# EAGLE design LiPoDisp (EAGLE 5.07)
BEST: Farnell 1081223
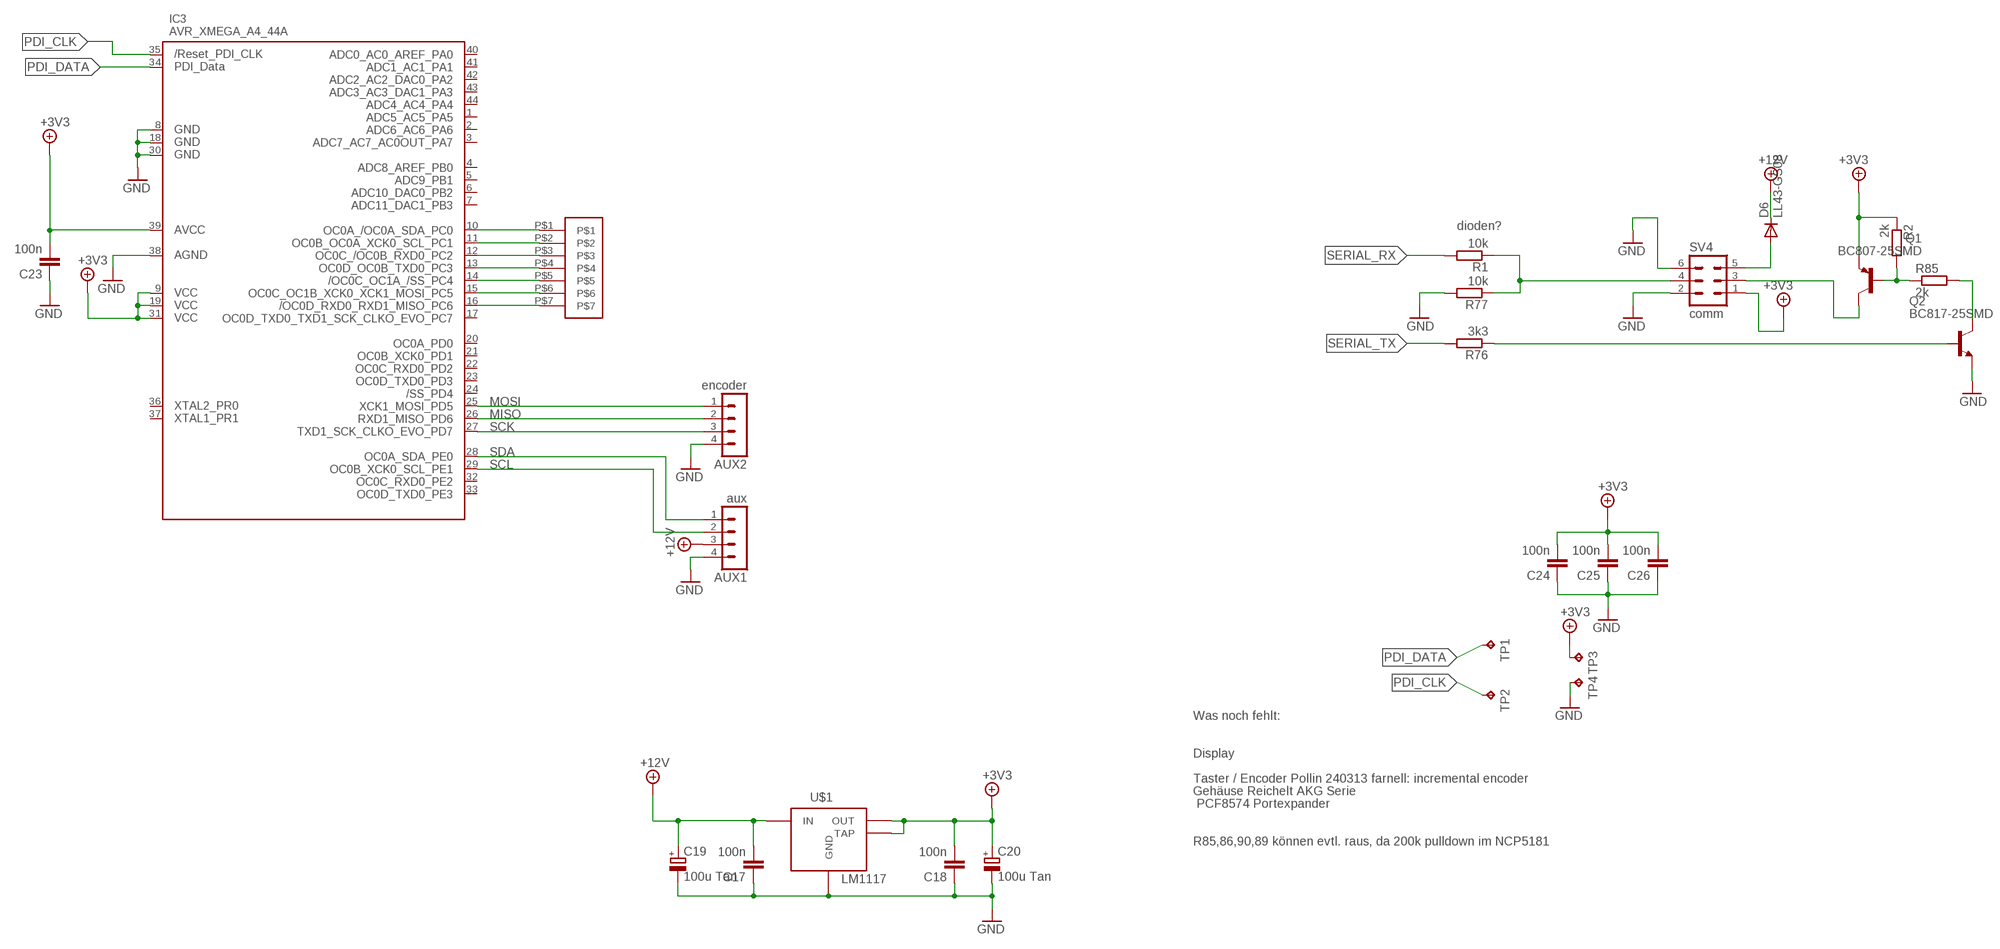
[diagram p0: schematic, sheet 1]

## Parts
AUX1  aux  MA04-1  [MA04-1]
AUX2  encoder  MA04-1  [MA04-1]
C17  100n  C-EUC0603K  [C0603K]
C18  100n  C-EUC0603K  [C0603K]
C19  100u Tan  CPOL-EUSMCC  [SMC_C]
C20  100u Tan  CPOL-EUSMCC  [SMC_C]
C23  100n  C-EUC0603K  [C0603K]
C24  100n  C-EUC0603K  [C0603K]
C25  100n  C-EUC0603K  [C0603K]
C26  100n  C-EUC0603K  [C0603K]
D6  LL43-GS08  DIODE-SOD80C  [SOD80C]
IC3  AVR_XMEGA_A4_44A  [TQFP44]
Q1  BC807-25SMD  [SOT23-BEC]
Q2  BC817-25SMD  [SOT23-BEC]
R1  10k  R-EU_R0603  [R0603]
R2  2k  R-EU_R0603  [R0603]
R76  3k3  R-EU_R0603  [R0603]
R77  10k  R-EU_R0603  [R0603]
R85  2k  R-EU_R0603  [R0603]
SV4  comm  ML6L  [ML6L]
TP1  TPTP15R  [TP15R]
TP2  TPTP15R  [TP15R]
TP3  TPTP15R  [TP15R]
TP4  TPTP15R  [TP15R]
U$1  LM1117  [SOT223]
U$3  SLIDER-7  [TP7-36]

## Nets
+3V3 [Lo-Power]: C18.2 C20.+ C23.2 C24.2 C25.2 C26.2 IC3.9(VCC1) IC3.19(VCC2) IC3.31(VCC3) IC3.39(AVCC) Q1.E R2.1 SV4.1 TP3.TP U$1.MID(OUT) U$1.TAP
+12V [Lo-Power]: AUX1.3 C17.2 C19.+ D6.C U$1.RIGHT(IN)
GND [Lo-Power]: AUX1.4 AUX2.4 C17.1 C18.1 C19.- C20.- C23.1 C24.1 C25.1 C26.1 IC3.8(GND1) IC3.18(GND2) IC3.30(GND3) IC3.38(AGND) Q2.E R77.2 SV4.2 SV4.6 TP4.TP U$1.LEFT(GND)
MISO: AUX2.2 IC3.26(PD6)
MOSI: AUX2.1 IC3.25(PD5)
N$2: Q2.C R85.2
N$3: Q1.C SV4.3
N$4: Q1.B R2.2 R85.1
N$5: IC3.10(PC0) U$3.P$1
N$6: IC3.11(PC1) U$3.P$2
N$7: IC3.12(PC2) U$3.P$3
N$8: IC3.13(PC3) U$3.P$4
N$9: IC3.14(PC4) U$3.P$5
N$10: Q2.B R76.1
N$11: IC3.15(PC5) U$3.P$6
N$12: IC3.16(PC6) U$3.P$7
N$84 [Lo-Power]: D6.A SV4.5
PDI_CLK: IC3.35(RESET) TP2.TP
PDI_DATA: IC3.34(PDI_DATA) TP1.TP
SCK: AUX2.3 IC3.27(PD7)
SCL: AUX1.2 IC3.29(PE1)
SDA: AUX1.1 IC3.28(PE0)
SERIAL_RX: R1.2
SERIAL_RX_R: R1.1 R77.1 SV4.4
SERIAL_TX: R76.2
Unconnected: IC3.1(PA5) IC3.2(PA6) IC3.3(PA7) IC3.4(PB0) IC3.5(PB1) IC3.6(PB2) IC3.7(PB3) IC3.17(PC7) IC3.20(PD0) IC3.21(PD1) IC3.22(PD2) IC3.23(PD3) IC3.24(PD4) IC3.32(PE2) IC3.33(PE3) IC3.36(PR0) IC3.37(PR1) IC3.40(PA0) IC3.41(PA1) IC3.42(PA2) IC3.43(PA3) IC3.44(PA4)

## Notes on the sheet
- dioden?
- Was noch fehlt:
- Display
- Taster / Encoder Pollin 240313 farnell: incremental encoder
- Gehäuse Reichelt AKG Serie
- PCF8574 Portexpander
- R85,86,90,89 können evtl. raus, da 200k pulldown im NCP5181

## Library data of the parts
AUX1 AUX2 = Fabian:MA04-1: PIN HEADER
C17 C18 C23-C26 = rcl:C-EU: CAPACITOR, European symbol
C19 C20 = rcl:CPOL-EU: POLARIZED CAPACITOR, European symbol
D6 = diode:DIODE-: DIODE
IC3 = xmega:AVR_XMEGA_A4_: Device for Atmel AVR XMEGA A4 Series
Q1 = transistor-pnp:BC807*: PNP Transistror
Q2 = transistor-npn:BC817*: NPN Transistor
R1 R2 R76 R77 R85 = rcl:R-EU_: RESISTOR, European symbol
SV4 = con-harting-ml:ML6: HARTING
TP1-TP4 = testpad:TP: Test pad
U$1 = Fabian:LM1117: lm1117 from National semi, buy from onlinecomponents.com add at least 10 uF at output Order No: LM1117MP-3.3
U$3 = Touch-pads:SLIDER-7

## Net classes
0 default: width 0.2 mm
1 Hi-Power: width 0.3 mm
2 Lo-Power: width 0.3 mm
3 Iso-bus: clearance 0.6 mm to class 0, clearance 0.6 mm to class 1, clearance 0.6 mm to class 2

## Board
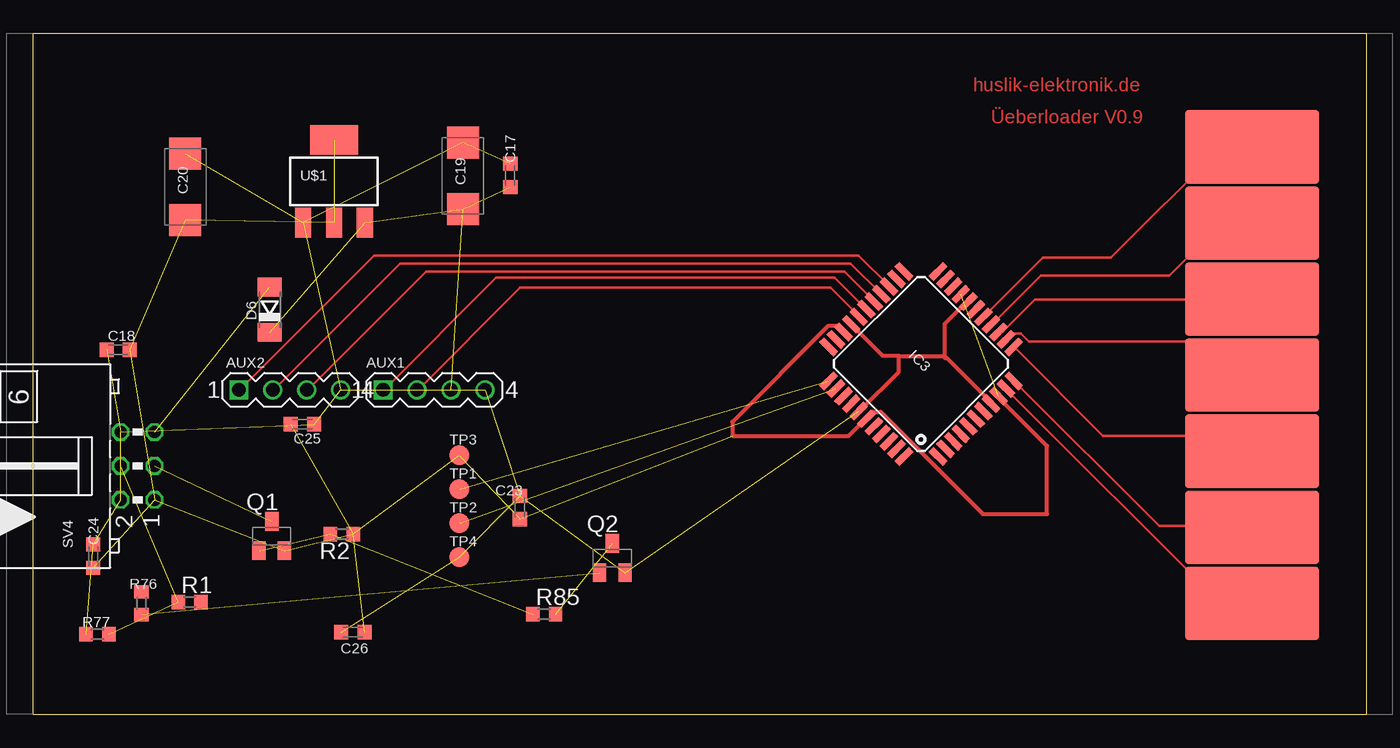
[diagram p1: board, top side]

Size 99.8 x 51 mm. Coordinates in mm from the lower left corner, seen from the top.
Copper layers (1*16): Top 0.035mm / dielectric 1.5mm / Bottom 0.035mm
Design rules "Fischer-LP *": minimum track width 0.15mm, minimum drill 0.3mm, track to track 0.15mm, track to pad 0.15mm, pad to pad 0.15mm, via to via 0.15mm, smd to smd 0mil, copper to edge 0.2mm, drill to drill 0.3mm, minimum pad ring 0.2mm, minimum via ring 0.15mm, stop-mask expansion 0.1mm, vias tented up to drill 0.5mm, thermal gap 0.15mm

### Footprints (pad centres in the part's own frame; a part is rotated, then mirrored left to right if it is on the bottom)
MA04-1 = drill 1.016 square: 1 -3.81,0 | drill 1.016 round: 2 -1.27,0; 3 1.27,0; 4 3.81,0
C0603K = smd 1.05 x 1.08: 1 -0.875,0; 2 0.875,0
SMC_C = smd 2.4 x 2.4: + -2.5,0; - 2.5,0
SOD80C = smd 1.4 x 1.8: A 1.7,0; C -1.7,0
TQFP44 = smd 1.5 x 0.5: 1 -5.8,4; 2 -5.8,3.2; 3 -5.8,2.4; 4 -5.8,1.6; 5 -5.8,0.8; 6 -5.8,0; 7 -5.8,-0.8; 8 -5.8,-1.6; 9 -5.8,-2.4; 10 -5.8,-3.2; 11 -5.8,-4; 23 5.8,-4; 24 5.8,-3.2; 25 5.8,-2.4; 26 5.8,-1.6; 27 5.8,-0.8; 28 5.8,0; 29 5.8,0.8; 30 5.8,1.6; 31 5.8,2.4; 32 5.8,3.2; 33 5.8,4 | smd 0.5 x 1.5: 12 -4,-5.8; 13 -3.2,-5.8; 14 -2.4,-5.8; 15 -1.6,-5.8; 16 -0.8,-5.8; 17 0,-5.8; 18 0.8,-5.8; 19 1.6,-5.8; 20 2.4,-5.8; 21 3.2,-5.8; 22 4,-5.8; 34 4,5.8; 35 3.2,5.8; 36 2.4,5.8; 37 1.6,5.8; 38 0.8,5.8; 39 0,5.8; 40 -0.8,5.8; 41 -1.6,5.8; 42 -2.4,5.8; 43 -3.2,5.8; 44 -4,5.8
SOT23-BEC = smd 1 x 1.4: B -0.95,-1.1; C 0,1.1; E 0.95,-1.1
R0603 = smd 1 x 1.1: 1 -0.85,0; 2 0.85,0
ML6L = drill 0.914 octagon: 1 -2.54,-1.27; 2 -2.54,1.27; 3 0,-1.27; 4 0,1.27; 5 2.54,-1.27; 6 2.54,1.27
TP15R = smd 1.5 x 1.5: TP 0,0
SOT223 = smd 1.219 x 2.235: LEFT -2.311,-3.099; MID 0,-3.099; RIGHT 2.311,-3.099 | smd 3.6 x 2.2: TAP 0,3.099
TP7-36 = smd 5.5 x 10: P$1 2.75,-5; P$2 8.45,-5; P$3 14.15,-5; P$4 19.85,-5; P$5 25.55,-5; P$6 31.25,-5; P$7 36.95,-5

### Placement (x,y rotation side)
AUX1  30,24.3 0 top
AUX2  19.2,24.3 0 top
C17  35.7,40.35 270 top
C18  6.35,27.3 0 top
C19  32.17,40.33 90 top
C20  11.38,39.5 90 top
C23  36.43,15.49 270 top
C24  4.48,11.86 270 top
C25  20.16,21.71 180 top
C26  23.93,6.14 0 top
D6  17.7,30.3 90 top
IC3  66.47,26.24 135 top
Q1  17.85,13.35 0 top
Q2  43.35,11.7 0 top
R1  11.7,8.4 0 top
R2  23.1,13.5 180 top
R76  8.1,8.31 90 top
R77  4.8,6 180 top
R85  38.25,7.5 0 top
SV4  7.8,18.6 90 top
TP1  31.89,16.84 0 top
TP2  31.89,14.3 0 top
TP3  31.89,19.39 0 top
TP4  31.89,11.77 0 top
U$1  22.52,39.92 0 top
U$2  [GEH_FISCHER_AKG55XX100]  0,0 0 top
U$3  86.25,5.55 90 top

### Tracks (layer width: path | path; a pad name or v marks a point on that pad's centre or on a via)
+3V3  (13 unrouted)
  Top 0.3: IC3.9 72.3,23.7 75.9,20.1 75.9,15 71.1,15 63.45,22.65 62.85,22.65 62.4,22.2 IC3.39 62.25,22.05 61.05,20.85 52.35,20.85 52.35,21.9 59.55,29.1 60.15,29.1 60.6,28.65 IC3.31
+12V  (4 unrouted)
GND  (16 unrouted)
  Top 0.3: 68.25,26.85 68.25,26.7 68.4,26.7 71.7,23.4 IC3.8 | 68.25,26.85 68.25,29.25 69.9,30.9 IC3.18 | 64.8,26.85 63.6,26.85 61.35,29.1 IC3.30 | 64.8,26.85 68.25,26.85 | 64.8,26.85 64.8,25.65 61.95,22.8 IC3.38
MISO
  Top 0.2: IC3.26 63.45,31.5 61.2,33.75 27.45,33.75 18,24.3 AUX2.2
MOSI
  Top 0.2: IC3.25 64.05,32.1 61.8,34.35 25.5,34.35 15.45,24.3 AUX2.1
N$2  (1 unrouted)
N$3  (1 unrouted)
N$4  (2 unrouted)
N$5
  Top 0.2: U$3.P$1 91.2,8.4 88.8,8.4 72.9,24.3 IC3.10
N$6
  Top 0.2: U$3.P$2 91.2,14.1 84.3,14.1 73.5,24.9 IC3.11
N$7
  Top 0.2: IC3.12 73.5,27.45 80.1,20.85 90.15,20.85 91.2,19.8 U$3.P$3
N$8
  Top 0.2: IC3.13 72.9,28.2 73.2,28.5 73.95,28.5 74.55,27.9 88.8,27.9 91.2,25.5 U$3.P$4
N$9
  Top 0.2: IC3.14 72.3,28.65 72.6,28.65 75,31.05 91.2,31.05 U$3.P$5
N$10  (1 unrouted)
N$11
  Top 0.2: IC3.15 71.85,29.25 75.45,32.85 85.05,32.85 88.95,36.75 91.2,36.75 U$3.P$6
N$12
  Top 0.2: IC3.16 71.25,29.85 75.6,34.2 80.7,34.2 88.95,42.45 91.2,42.45 U$3.P$7
N$84  (1 unrouted)
PDI_CLK  (1 unrouted)
PDI_DATA  (1 unrouted)
SCK
  Top 0.2: IC3.27 62.85,31.05 60.75,33.15 29.4,33.15 20.55,24.3 AUX2.3
SCL
  Top 0.2: IC3.29 61.8,29.85 59.7,31.95 36.45,31.95 28.8,24.3 AUX1.2
SDA
  Top 0.2: IC3.28 62.25,30.45 60,32.7 34.65,32.7 26.25,24.3 AUX1.1
SERIAL_RX_R  (2 unrouted)

### Text on the board
Top: huslik-elektronik.de | Üeberloader V0.9